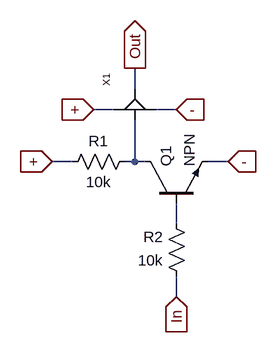
[diagram p0: schematic NOT.asc]
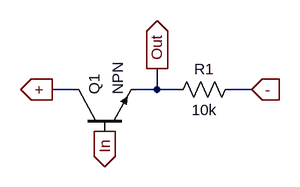
[diagram p1: sub-circuit buffer.asc]
NOT.asc, the LTspice schematic file:
Version 4
SHEET 1 880 680
WIRE 112 16 112 -16
WIRE 80 48 48 48
WIRE 176 48 144 48
WIRE 16 128 -16 128
WIRE 112 128 112 64
WIRE 112 128 96 128
WIRE 128 128 112 128
WIRE 256 128 224 128
WIRE 176 224 176 192
WIRE 176 336 176 304
FLAG -16 128 +
IOPIN -16 128 In
FLAG 256 128 -
IOPIN 256 128 In
FLAG 176 336 In
IOPIN 176 336 In
FLAG 112 -16 Out
IOPIN 112 -16 Out
FLAG 48 48 +
IOPIN 48 48 In
FLAG 176 48 -
IOPIN 176 48 In
SYMBOL npn 128 192 R270
SYMATTR InstName Q1
SYMBOL res 112 112 R90
WINDOW 0 0 56 VBottom 2
WINDOW 3 32 56 VTop 2
SYMATTR InstName R1
SYMATTR Value 10k
SYMBOL res 192 320 R180
WINDOW 0 36 76 Left 2
WINDOW 3 36 40 Left 2
SYMATTR InstName R2
SYMATTR Value 10k
SYMBOL Buffer 112 64 R270
SYMATTR InstName X1

buffer.asc, the sub-circuit schematic file:
Version 4
SHEET 1 880 680
WIRE 48 112 16 112
WIRE 176 112 176 80
WIRE 176 112 144 112
WIRE 208 112 176 112
WIRE 320 112 288 112
FLAG 176 80 Out
IOPIN 176 80 Out
FLAG 16 112 +
IOPIN 16 112 Out
FLAG 96 176 In
IOPIN 96 176 Out
FLAG 320 112 -
IOPIN 320 112 In
SYMBOL npn 48 176 R270
SYMATTR InstName Q1
SYMBOL res 304 96 R90
WINDOW 0 0 56 VBottom 2
WINDOW 3 32 56 VTop 2
SYMATTR InstName R1
SYMATTR Value 10k

The netlist it stands for:
* NOT.asc
Q1 N001 N002 - 0 NPN
R1 N001 + 10k
R2 In N002 10k
XX1 N001 Out + - buffer

* block symbol definitions
.subckt buffer In Out + -
Q1 + In Out 0 NPN
R1 - Out 10k
.ends buffer

.model NPN NPN
.model PNP PNP
.lib standard.bjt
.backanno
.end